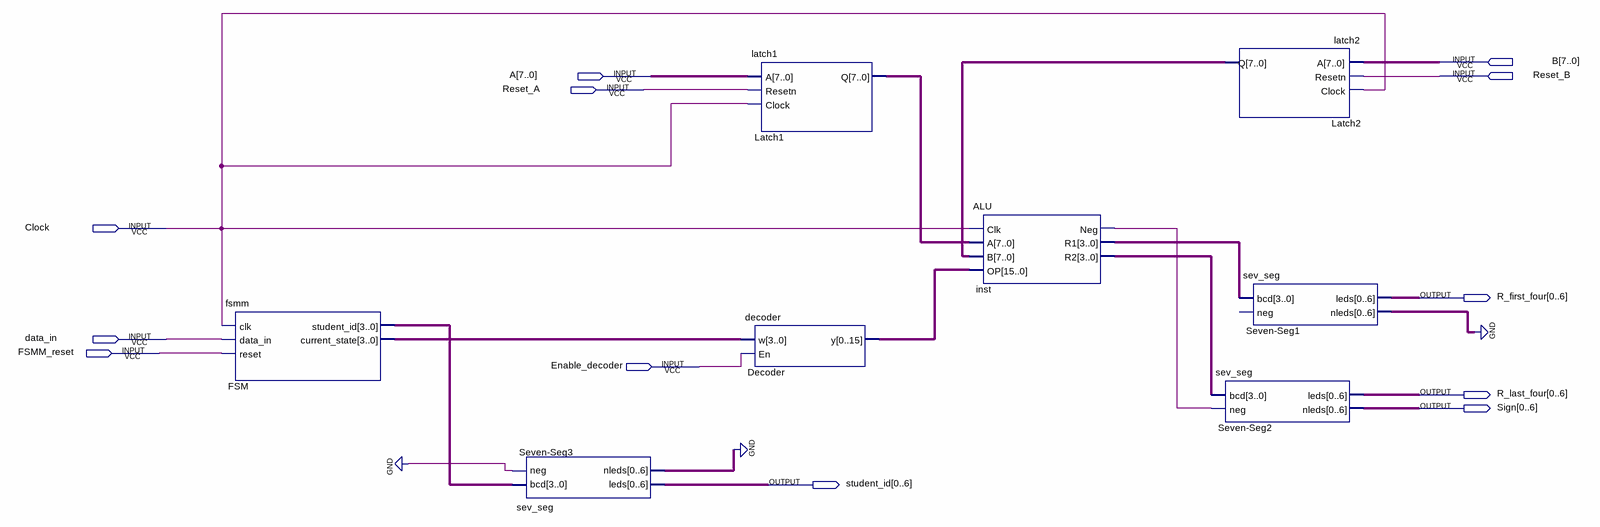
[diagram p0: schematic sheet]
// Quartus schematic GPU-ALU.bdf as structural Verilog: 8 symbols, 12 pins
module \GPU-ALU  (
  input  [7:0] B,
  input  [7:0] A,
  input  Reset_B,
  input  Reset_A,
  input  Clock,
  input  data_in,
  input  FSMM_reset,
  input  Enable_decoder,
  output [0:6] R_first_four,
  output [0:6] R_last_four,
  output [0:6] Sign,
  output [0:6] student_id
);

  wire inst_neg;
  wire [3:0] FSM_current_state, FSM_student_id, inst_r1, inst_r2;
  wire [6:0] Seven_Seg1_nleds, Seven_Seg3_nleds;
  wire [7:0] Latch1_q, Latch2_q;
  wire [15:0] Decoder_y;

  fsmm FSM (
    .clk(Clock), .data_in(data_in), .reset(FSMM_reset), .student_id(FSM_student_id),
    .current_state(FSM_current_state));
  sev_seg \Seven-Seg3  (.bcd(FSM_student_id), .neg(1'b0), .leds(student_id), .nleds(Seven_Seg3_nleds));
  latch1 Latch1 (.A(A), .Resetn(Reset_A), .Clock(Clock), .Q(Latch1_q));
  decoder Decoder (.w(FSM_current_state), .En(Enable_decoder), .y(Decoder_y));
  ALU inst (.Clk(Clock), .A(Latch1_q), .B(Latch2_q), .OP(Decoder_y), .Neg(inst_neg), .R1(inst_r1), .R2(inst_r2));
  sev_seg \Seven-Seg2  (.bcd(inst_r2), .neg(inst_neg), .leds(R_last_four), .nleds(Sign));
  latch2 Latch2 (.A(B), .Resetn(Reset_B), .Clock(Clock), .Q(Latch2_q));
  sev_seg \Seven-Seg1  (.bcd(inst_r1), .leds(R_first_four), .nleds(Seven_Seg1_nleds));  // open: neg
  // also tied to GND on the sheet: {Seven_Seg3_nleds[0], Seven_Seg3_nleds[1], Seven_Seg3_nleds[2], Seven_Seg3_nleds[3], Seven_Seg3_nleds[4], Seven_Seg3_nleds[5], Seven_Seg3_nleds[6], Seven_Seg1_nleds[0], Seven_Seg1_nleds[1], Seven_Seg1_nleds[2], Seven_Seg1_nleds[3], Seven_Seg1_nleds[4], Seven_Seg1_nleds[5], Seven_Seg1_nleds[6]}
endmodule
